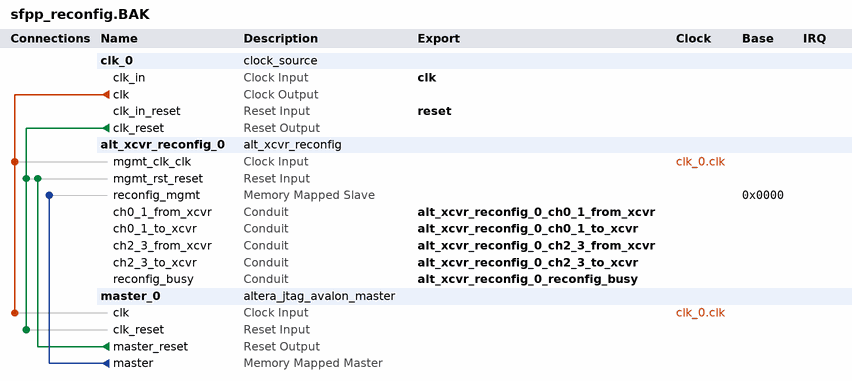
[diagram p0: system contents]
# Platform Designer (Qsys) system sfpp_reconfig.BAK, Stratix V 5SGXMA7H2F35C2
# Parameters at their usual value, and those the tool derives, are not listed.
package require -exact qsys 13.1
create_system sfpp_reconfig.BAK
set_project_property DEVICE_FAMILY {Stratix V}
set_project_property DEVICE 5SGXMA7H2F35C2

add_instance clk_0 clock_source 13.1
set_instance_parameter_value clk_0 clockFrequency 50000000

add_instance alt_xcvr_reconfig_0 alt_xcvr_reconfig 13.1
set_instance_parameter_value alt_xcvr_reconfig_0 device_family {Stratix V}
set_instance_parameter_value alt_xcvr_reconfig_0 number_of_reconfig_interfaces 4
set_instance_parameter_value alt_xcvr_reconfig_0 gui_split_sizes 2,2
set_instance_parameter_value alt_xcvr_reconfig_0 enable_analog 1
set_instance_parameter_value alt_xcvr_reconfig_0 enable_eyemon 1
set_instance_parameter_value alt_xcvr_reconfig_0 ber_en 1
set_instance_parameter_value alt_xcvr_reconfig_0 enable_adce 0

add_instance master_0 altera_jtag_avalon_master 13.1

# connections
add_connection clk_0.clk alt_xcvr_reconfig_0.mgmt_clk_clk clock
add_connection clk_0.clk master_0.clk clock
add_connection clk_0.clk_reset alt_xcvr_reconfig_0.mgmt_rst_reset reset
add_connection clk_0.clk_reset master_0.clk_reset reset
add_connection master_0.master_reset alt_xcvr_reconfig_0.mgmt_rst_reset reset
add_connection master_0.master alt_xcvr_reconfig_0.reconfig_mgmt avalon
set_connection_parameter_value master_0.master/alt_xcvr_reconfig_0.reconfig_mgmt baseAddress 0x0000

# exported interfaces
add_interface clk clock sink
set_interface_property clk EXPORT_OF clk_0.clk_in
add_interface reset reset sink
set_interface_property reset EXPORT_OF clk_0.clk_in_reset
add_interface alt_xcvr_reconfig_0_ch0_1_to_xcvr conduit end
set_interface_property alt_xcvr_reconfig_0_ch0_1_to_xcvr EXPORT_OF alt_xcvr_reconfig_0.ch0_1_to_xcvr
add_interface alt_xcvr_reconfig_0_ch0_1_from_xcvr conduit end
set_interface_property alt_xcvr_reconfig_0_ch0_1_from_xcvr EXPORT_OF alt_xcvr_reconfig_0.ch0_1_from_xcvr
add_interface alt_xcvr_reconfig_0_ch2_3_to_xcvr conduit end
set_interface_property alt_xcvr_reconfig_0_ch2_3_to_xcvr EXPORT_OF alt_xcvr_reconfig_0.ch2_3_to_xcvr
add_interface alt_xcvr_reconfig_0_ch2_3_from_xcvr conduit end
set_interface_property alt_xcvr_reconfig_0_ch2_3_from_xcvr EXPORT_OF alt_xcvr_reconfig_0.ch2_3_from_xcvr
add_interface alt_xcvr_reconfig_0_reconfig_busy conduit end
set_interface_property alt_xcvr_reconfig_0_reconfig_busy EXPORT_OF alt_xcvr_reconfig_0.reconfig_busy

set_interconnect_requirement {$system} qsys_mm.clockCrossingAdapter HANDSHAKE
set_interconnect_requirement {$system} qsys_mm.maxAdditionalLatency 1
set_interconnect_requirement {$system} qsys_mm.insertDefaultSlave false

save_system sfpp_reconfig.BAK.qsys
